# Altium schematic sheet Functional Schematic 19-in rack-mount.SchDoc
size C
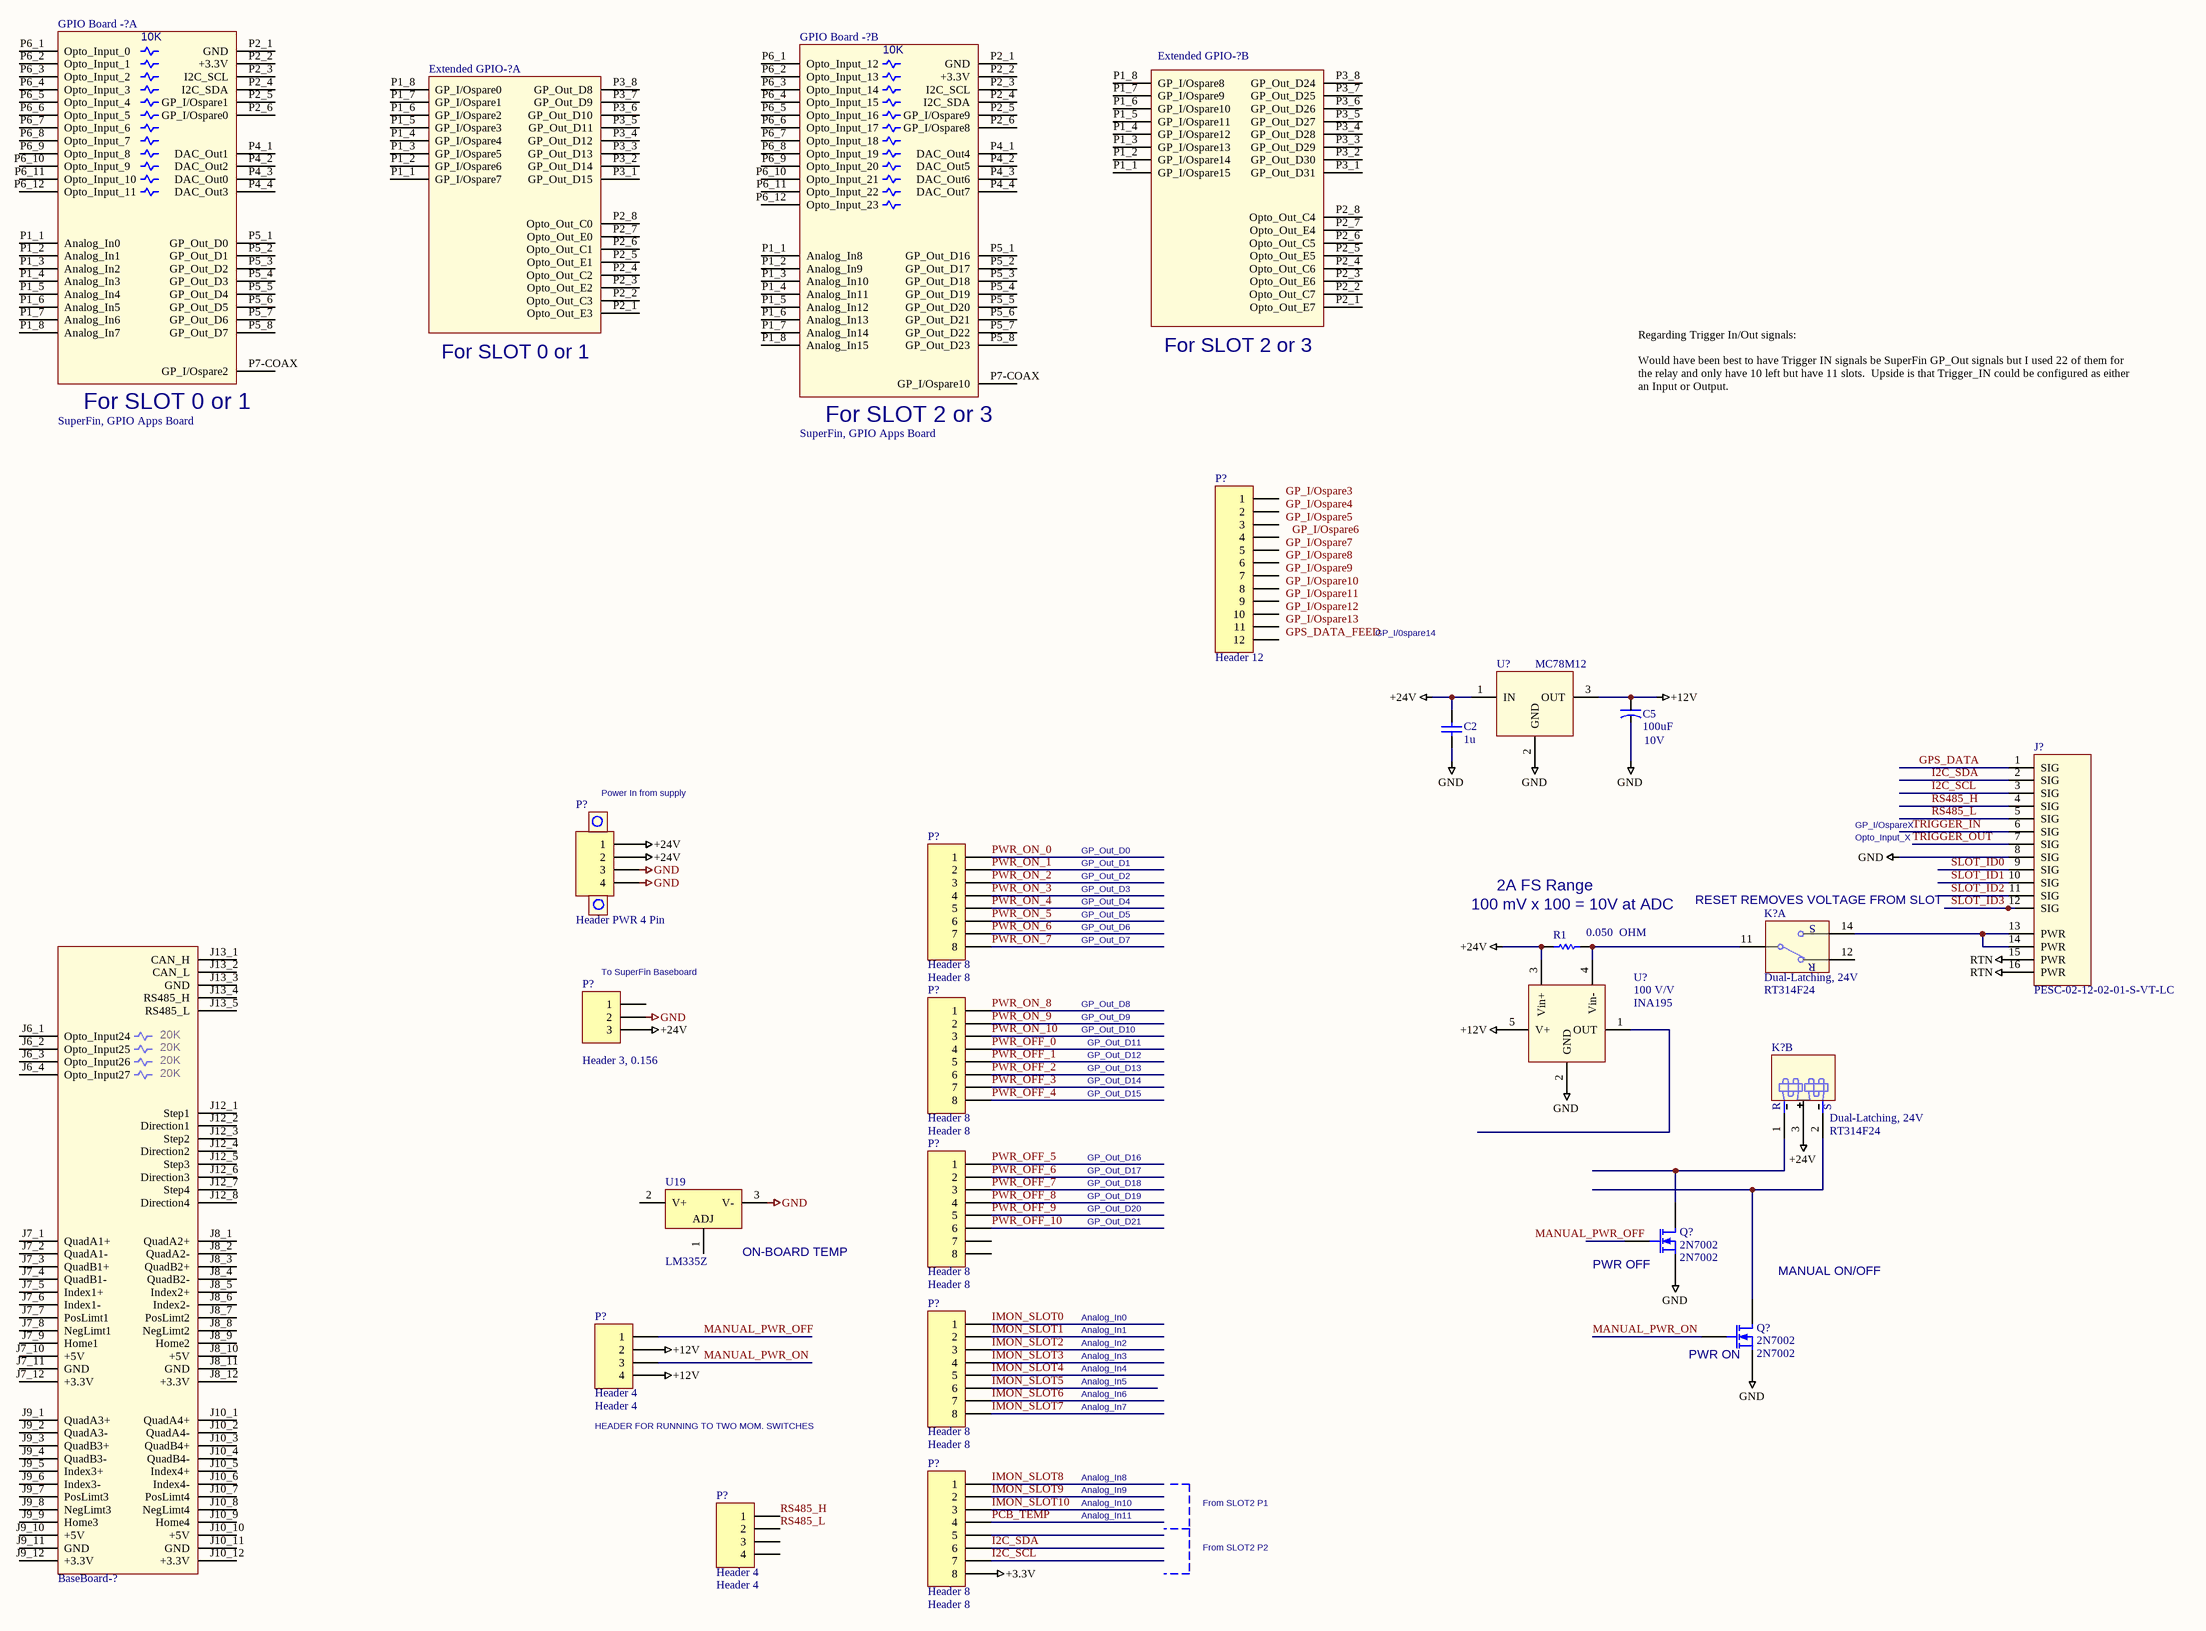
[diagram p0: Functional Schematic 19-in rack-mount.SchDoc]

## Parts
(Parts that share a designator on the sheet are numbered #1, #2 ... from top to bottom, then left to right.)
BaseBoard-?  SuperFin BaseBoard  (value not drawn)
C2  1u  [2012[0805]]
C5  10V  value 100uF  [SMD_CAP_7343]
Extended_GPIO-?#1  SuperFin, Extended GPIO Apps Board  (value not drawn)  (part B of 2)
Extended_GPIO-?#2  SuperFin, Extended GPIO Apps Board  (value not drawn)  (part A of 2)
GPIO_Board_-?#1  SuperFin, GPIO Apps Board  (part A of 2)
GPIO_Board_-?#2  SuperFin, GPIO Apps Board  (part B of 2)
J?  PESC-02-12-02-01-S-VT-LC  [PESC-02-12-02-01-S-VT-LC]
K?#1  Dual-Latching, 24V  value RT314F24  [RELAY, TYCO RT1]  (part A of 2)
K?#2  Dual-Latching, 24V  value RT314F24  [RELAY, TYCO RT1]  (part B of 2)
P?#1  Header 12  [HDR1X12 for IDC]
P?#2  Header PWR 4 Pin  [HDR-4 pin w/screw]
P?#3  Header 8  [HDR1X8 for IDC]
P?#4  value Header 3, 0.156  [HDR 1X3 0.156"]  (hidden comment: Header 3)
P?#5  Header 8  [HDR1X8 for IDC]
P?#6  Header 8  [HDR1X8 for IDC]
P?#7  Header 8  [HDR1X8 for IDC]
P?#8  Header 4  [HDR1X4 for IDC]
P?#9  Header 8  [HDR1X8 for IDC]
P?#10  Header 4  [HDR1X4 for IDC]
Q?#1  2N7002  [SOT23A]
Q?#2  2N7002  [SOT23A]
R1  value 0.050  OHM  [SMD_0805]  (hidden comment: Res 0805)
U19  LM335Z  [Z03A]
U?#1  value MC78M12  [TO-252(D-PAK)  PowerPAD]  (hidden comment: Voltage Reg, Fixed)
U?#2  100 V/V  value INA195  [SOT23-5]

## Nets
+3.3V: P?#9.8
+12V: C5.pos P?#8.2 P?#8.4 U?#1.3(OUT) U?#2.5(V+)
+24V: C2.1 K?#2.3(Com) P?#2.1 P?#2.2 P?#4.3 R1.1 U?#1.1(IN) U?#2.3(Vin+)
GND: C2.2 C5.neg J?.8(SIG) P?#2.3 P?#2.4 P?#4.2 Q?#1.2(S) Q?#2.2(S) U19.3(V-) U?#1.2(GND) U?#2.2(GND)
RTN: J?.15(PWR) J?.16(PWR)
GPS_DATA: J?.1(SIG)
I2C_SCL: J?.3(SIG) P?#9.7
I2C_SDA: J?.2(SIG) P?#9.6
IMON_SLOT0: P?#7.1
IMON_SLOT1: P?#7.2
IMON_SLOT2: P?#7.3
IMON_SLOT3: P?#7.4
IMON_SLOT4: P?#7.5
IMON_SLOT5: P?#7.6
IMON_SLOT6: P?#7.7
IMON_SLOT7: P?#7.8
IMON_SLOT8: P?#9.1
IMON_SLOT9: P?#9.2
IMON_SLOT10: P?#9.3
MANUAL_PWR_OFF: P?#8.1
MANUAL_PWR_ON: P?#8.3 Q?#2.1(G)
PCB_TEMP: P?#9.4
PWR_OFF_0: P?#5.4
PWR_OFF_1: P?#5.5
PWR_OFF_2: P?#5.6
PWR_OFF_3: P?#5.7
PWR_OFF_4: P?#5.8
PWR_OFF_5: P?#6.1
PWR_OFF_6: P?#6.2
PWR_OFF_7: P?#6.3
PWR_OFF_8: P?#6.4
PWR_OFF_9: P?#6.5
PWR_OFF_10: P?#6.6
PWR_ON_0: P?#3.1
PWR_ON_1: P?#3.2
PWR_ON_2: P?#3.3
PWR_ON_3: P?#3.4
PWR_ON_4: P?#3.5
PWR_ON_5: P?#3.6
PWR_ON_6: P?#3.7
PWR_ON_7: P?#3.8
PWR_ON_8: P?#5.1
PWR_ON_9: P?#5.2
PWR_ON_10: P?#5.3
RS485_H: J?.4(SIG) P?#10.1
RS485_L: J?.5(SIG) P?#10.2
SLOT_ID0: J?.9(SIG)
SLOT_ID1: J?.10(SIG)
SLOT_ID2: J?.11(SIG)
SLOT_ID3: J?.12(SIG)
TRIGGER_IN: J?.6(SIG)
TRIGGER_OUT: J?.7(SIG)
NetJ?_13: J?.13(PWR) J?.14(PWR) K?#1.14(S)
NetK?#1_11: K?#1.11(Wiper) R1.2 U?#2.4(Vin-)
NetK?#2_1: K?#2.1(Reset) Q?#1.3(D)
NetK?#2_2: K?#2.2(Reset) Q?#2.3(D)

Not connected (* = marked no-connect by the designer): BaseBoard-? J6_1(Opto_Input24) J6_2(Opto_Input25) J6_3(Opto_Input26) J6_4(Opto_Input27) J7_1(QuadA1+) J7_2(QuadA1-) J7_3(QuadB1+) J7_4(QuadB1-) J7_5(Index1+) J7_6(Index1-) J7_7(PosLimt1) J7_8(NegLimt1) J7_9(Home1) J7_10(+5V) J7_11(GND) J7_12(+3.3V) J8_1(QuadA2+) J8_2(QuadA2-) J8_3(QuadB2+) J8_4(QuadB2-) J8_5(Index2+) J8_6(Index2-) J8_7(PosLimt2) J8_8(NegLimt2) J8_9(Home2) J8_10(+5V) J8_11(GND) J8_12(+3.3V) J9_1(QuadA3+) J9_2(QuadA3-) J9_3(QuadB3+) J9_4(QuadB3-) J9_5(Index3+) J9_6(Index3-) J9_7(PosLimt3) J9_8(NegLimt3) J9_9(Home3) J9_10(+5V) J9_11(GND) J9_12(+3.3V) J10_1(QuadA4+) J10_2(QuadA4-) J10_3(QuadB4+) J10_4(QuadB4-) J10_5(Index4+) J10_6(Index4-) J10_7(PosLimt4) J10_8(NegLimt4) J10_9(Home4) J10_10(+5V) J10_11(GND) J10_12(+3.3V) J12_1(Step1) J12_2(Direction1) J12_3(Step2) J12_4(Direction2) J12_5(Step3) J12_6(Direction3) J12_7(Step4) J12_8(Direction4) J13_1(CAN_H) J13_2(CAN_L) J13_3(GND) J13_4(RS485_H) J13_5(RS485_L); Extended_GPIO-?#1 P1_1(GP_I/Ospare15) P1_2(GP_I/Ospare14) P1_3(GP_I/Ospare13) P1_4(GP_I/Ospare12) P1_5(GP_I/Ospare11) P1_6(GP_I/Ospare10) P1_7(GP_I/Ospare9) P1_8(GP_I/Ospare8) P2_1(Opto_Out_E7) P2_2(Opto_Out_C7) P2_3(Opto_Out_E6) P2_4(Opto_Out_C6) P2_5(Opto_Out_E5) P2_6(Opto_Out_C5) P2_7(Opto_Out_E4) P2_8(Opto_Out_C4) P3_1(GP_Out_D31) P3_2(GP_Out_D30) P3_3(GP_Out_D29) P3_4(GP_Out_D28) P3_5(GP_Out_D27) P3_6(GP_Out_D26) P3_7(GP_Out_D25) P3_8(GP_Out_D24); Extended_GPIO-?#2 P1_1(GP_I/Ospare7) P1_2(GP_I/Ospare6) P1_3(GP_I/Ospare5) P1_4(GP_I/Ospare4) P1_5(GP_I/Ospare3) P1_6(GP_I/Ospare2) P1_7(GP_I/Ospare1) P1_8(GP_I/Ospare0) P2_1(Opto_Out_E3) P2_2(Opto_Out_C3) P2_3(Opto_Out_E2) P2_4(Opto_Out_C2) P2_5(Opto_Out_E1) P2_6(Opto_Out_C1) P2_7(Opto_Out_E0) P2_8(Opto_Out_C0) P3_1(GP_Out_D15) P3_2(GP_Out_D14) P3_3(GP_Out_D13) P3_4(GP_Out_D12) P3_5(GP_Out_D11) P3_6(GP_Out_D10) P3_7(GP_Out_D9) P3_8(GP_Out_D8); GPIO_Board_-?#1 P1_1(Analog_In0) P1_2(Analog_In1) P1_3(Analog_In2) P1_4(Analog_In3) P1_5(Analog_In4) P1_6(Analog_In5) P1_7(Analog_In6) P1_8(Analog_In7) P2_1(GND) P2_2(+3.3V) P2_3(I2C_SCL) P2_4(I2C_SDA) P2_5(GP_I/Ospare1) P2_6(GP_I/Ospare0) P4_1(DAC_Out1) P4_2(DAC_Out2) P4_3(DAC_Out0) P4_4(DAC_Out3) P5_1(GP_Out_D0) P5_2(GP_Out_D1) P5_3(GP_Out_D2) P5_4(GP_Out_D3) P5_5(GP_Out_D4) P5_6(GP_Out_D5) P5_7(GP_Out_D6) P5_8(GP_Out_D7) P6_1(Opto_Input_0) P6_2(Opto_Input_1) P6_3(Opto_Input_2) P6_4(Opto_Input_3) P6_5(Opto_Input_4) P6_6(Opto_Input_5) P6_7(Opto_Input_6) P6_8(Opto_Input_7) P6_9(Opto_Input_8) P6_10(Opto_Input_9) P6_11(Opto_Input_10) P6_12(Opto_Input_11) P7-COAX(GP_I/Ospare2); GPIO_Board_-?#2 P1_1(Analog_In8) P1_2(Analog_In9) P1_3(Analog_In10) P1_4(Analog_In11) P1_5(Analog_In12) P1_6(Analog_In13) P1_7(Analog_In14) P1_8(Analog_In15) P2_1(GND) P2_2(+3.3V) P2_3(I2C_SCL) P2_4(I2C_SDA) P2_5(GP_I/Ospare9) P2_6(GP_I/Ospare8) P4_1(DAC_Out4) P4_2(DAC_Out5) P4_3(DAC_Out6) P4_4(DAC_Out7) P5_1(GP_Out_D16) P5_2(GP_Out_D17) P5_3(GP_Out_D18) P5_4(GP_Out_D19) P5_5(GP_Out_D20) P5_6(GP_Out_D21) P5_7(GP_Out_D22) P5_8(GP_Out_D23) P6_1(Opto_Input_12) P6_2(Opto_Input_13) P6_3(Opto_Input_14) P6_4(Opto_Input_15) P6_5(Opto_Input_16) P6_6(Opto_Input_17) P6_7(Opto_Input_18) P6_8(Opto_Input_19) P6_9(Opto_Input_20) P6_10(Opto_Input_21) P6_11(Opto_Input_22) P6_12(Opto_Input_23) P7-COAX(GP_I/Ospare10); K?#1 12(R); P?#1 1 2 3 4 5 6 7 8 9 10 11 12; P?#4 1; P?#6 7 8; P?#9 5; P?#10 3 4; Q?#1 1(G); U19 1(ADJ) 2(V+); U?#2 1(OUT)

## Notes on the sheet
- Regarding Trigger In/Out signals:
  Would have been best to have Trigger IN signals be SuperFin GP_Out signals but I used 22 of them for the relay and only have 10 left but have 11 slots.  Upside is that Trigger_IN could be configured as either an Input or Output.
- GP_I/0spare14
- (near P?#2) Power In from supply
- GP_I/OspareX
- GP_Out_D0
- GP_Out_D1
- GP_Out_D2
- GP_Out_D3
- 2A FS Range
- Opto_Input_X
- GP_Out_D4
- GP_Out_D5
- GP_Out_D6
- GP_Out_D7
- (near R1) 100 mV x 100 = 10V at ADC
- (near K?#1) RESET REMOVES VOLTAGE FROM SLOT
- (near P?#4) To SuperFin Baseboard
- GP_Out_D8
- GP_Out_D9
- GP_Out_D10
- GP_Out_D11
- GP_Out_D12
- GP_Out_D13
- GP_Out_D14
- GP_Out_D15
- GP_Out_D16
- GP_Out_D17
- GP_Out_D18
- GP_Out_D19
- GP_Out_D20
- (near U19) ON-BOARD TEMP
- GP_Out_D21
- (near Q?#1) PWR OFF
- MANUAL ON/OFF
- Analog_In0
- Analog_In1
- Analog_In2
- Analog_In3
- Analog_In4
- Analog_In5
- Analog_In6
- Analog_In7
- (near Q?#2) PWR ON
- (near P?#8) HEADER FOR RUNNING TO TWO MOM. SWITCHES
- Analog_In8
- Analog_In9
- Analog_In10
- Analog_In11
- From SLOT2 P1
- From SLOT2 P2
- Labels drawn without touching a wire or pin: GP_I/Ospare3, GP_I/Ospare4, GP_I/Ospare5, GP_I/Ospare6, GP_I/Ospare7, GP_I/Ospare8, GP_I/Ospare9, GP_I/Ospare10, GP_I/Ospare11, GP_I/Ospare12, GP_I/Ospare13, GPS_DATA_FEED, MANUAL_PWR_OFF
- (in symbol SuperFin BaseBoard) 20K
- (in symbol SuperFin, Extended GPIO Apps Board, part A) For SLOT 0 or 1
- (in symbol SuperFin, Extended GPIO Apps Board, part B) For SLOT 2 or 3
- (in symbol SuperFin, GPIO Apps Board, part A) 10K; For SLOT 0 or 1
- (in symbol SuperFin, GPIO Apps Board, part B) 10K; For SLOT 2 or 3

## Library data of the parts
C2 = Cap: Capacitor; Manufacturer: Taiyo Yuden; Manuf p/n: UMK212F105ZG-T; Vendor: DIGIKEY; Vendor Mult.: 10; Vendor p/n: 587-1308-1-ND; LCO p/n: 120-00027; Value: 1u; COST: 0.088
C5 = Cap Tant 35V: outline 6.0mm x 3.2mm; Manufacturer: kEMET; Manuf p/n: T520V107M010ATE045; Vendor: DigiKey; Vendor p/n: 399-4070-1-ND; Vendor Mult.: 1; LCO p/n: 120-00025; COST: 3.49
J? = PESC-02-12-02-01-S-VT-LC: SAMTEC, SIGNAL(12)+PWR(4), VERT
K?#1 K?#2 = Relay SPDT, 16A: Tyco/Schrack RT314F24, Dual Latching; Vendor: DigiKey; Vendor Mult.: 1; Vendor p/n: PB1086-ND; LCO p/n: 183-00001; COST: 3.79; Manufacturer: Tyco/Schrack; Manuf p/n: RT314F24
P?#1 = Header 12: Header, 12-Pin; Manufacturer: Tyco; Manuf p/n: 1-640456-2; Vendor: Digi-Key; Vendor p/n: A19475-ND; LCO p/n: XXXXXX; COST: 0.57; VALUE: Header 12
P?#2 = Header 4 PWR: Header, 4-Pin; Manufacturer: tyco; Manuf p/n: 796867-4; Vendor: Digi-key; Vendor p/n: A98457-ND; Vendor Mult.: 1; LCO p/n: 125-00082; VALUE: Header 4-pin PWR
P?#3 P?#5-P?#7 P?#9 = Header 8: Header, 8-Pin; VALUE: Header 8
P?#4 = Header 3, 0.156: Header, 3-Pin, 0.156; LCO p/n: 125-00083
P?#8 P?#10 = Header 4: Header, 4-Pin; LCO p/n: 125-00037; VALUE: Header 4
Q?#1 Q?#2 = 2N7002: N-Chan MOSFET; Manufacturer: STMicroelectronics; Vendor: Digi-Key; Vendor p/n: 497-3111-1-ND; Vendor Mult.: 1; LCO p/n: xxxxxx; Manuf p/n: 2N7002; COST: 0.45; VALUE: 2N7002
R1 = Res SMD: Resistor 0805; Manufacturer: Vishay/Dale; Manuf p/n: WSL0805R0500FEA18; Vendor: DIGIKEY; Vendor p/n: WSLB-.050CT-ND; Vendor Mult.: 1; LCO p/n: xxxxxxxxxxxxxxxxxxxxxxxxxxxxxxxx; COST: 1.07
U19 = LM335Z: Precision Temperature Sensor; Manufacturer: National Semiconductor; LCO p/n: 150-00068
U?#1 = Voltage Reg, Fixed: MC78M12; Manufacturer: On Semi; Manuf p/n: MC78M12CDTRKG; LCO p/n: 150-00081; Vendor: Digi-Key; Vendor Mult.: 1; Vendor p/n: MC78M12CDTRKGOSCT-ND; COST: 0.61
U?#2 = INA195: Current Shunt Monitor; Manufacturer: TI; Manuf p/n: INA195AIDBVR; LCO p/n: xxxxxxxxxxxxxxxxxxxxxxxx; Vendor: Digi-Key; Vendor Mult.: 1; Vendor p/n: 296-26067-1-ND; COST: 2.80